# Altium schematic sheet MCU.SchDoc
size A3; SheetNumber: 3
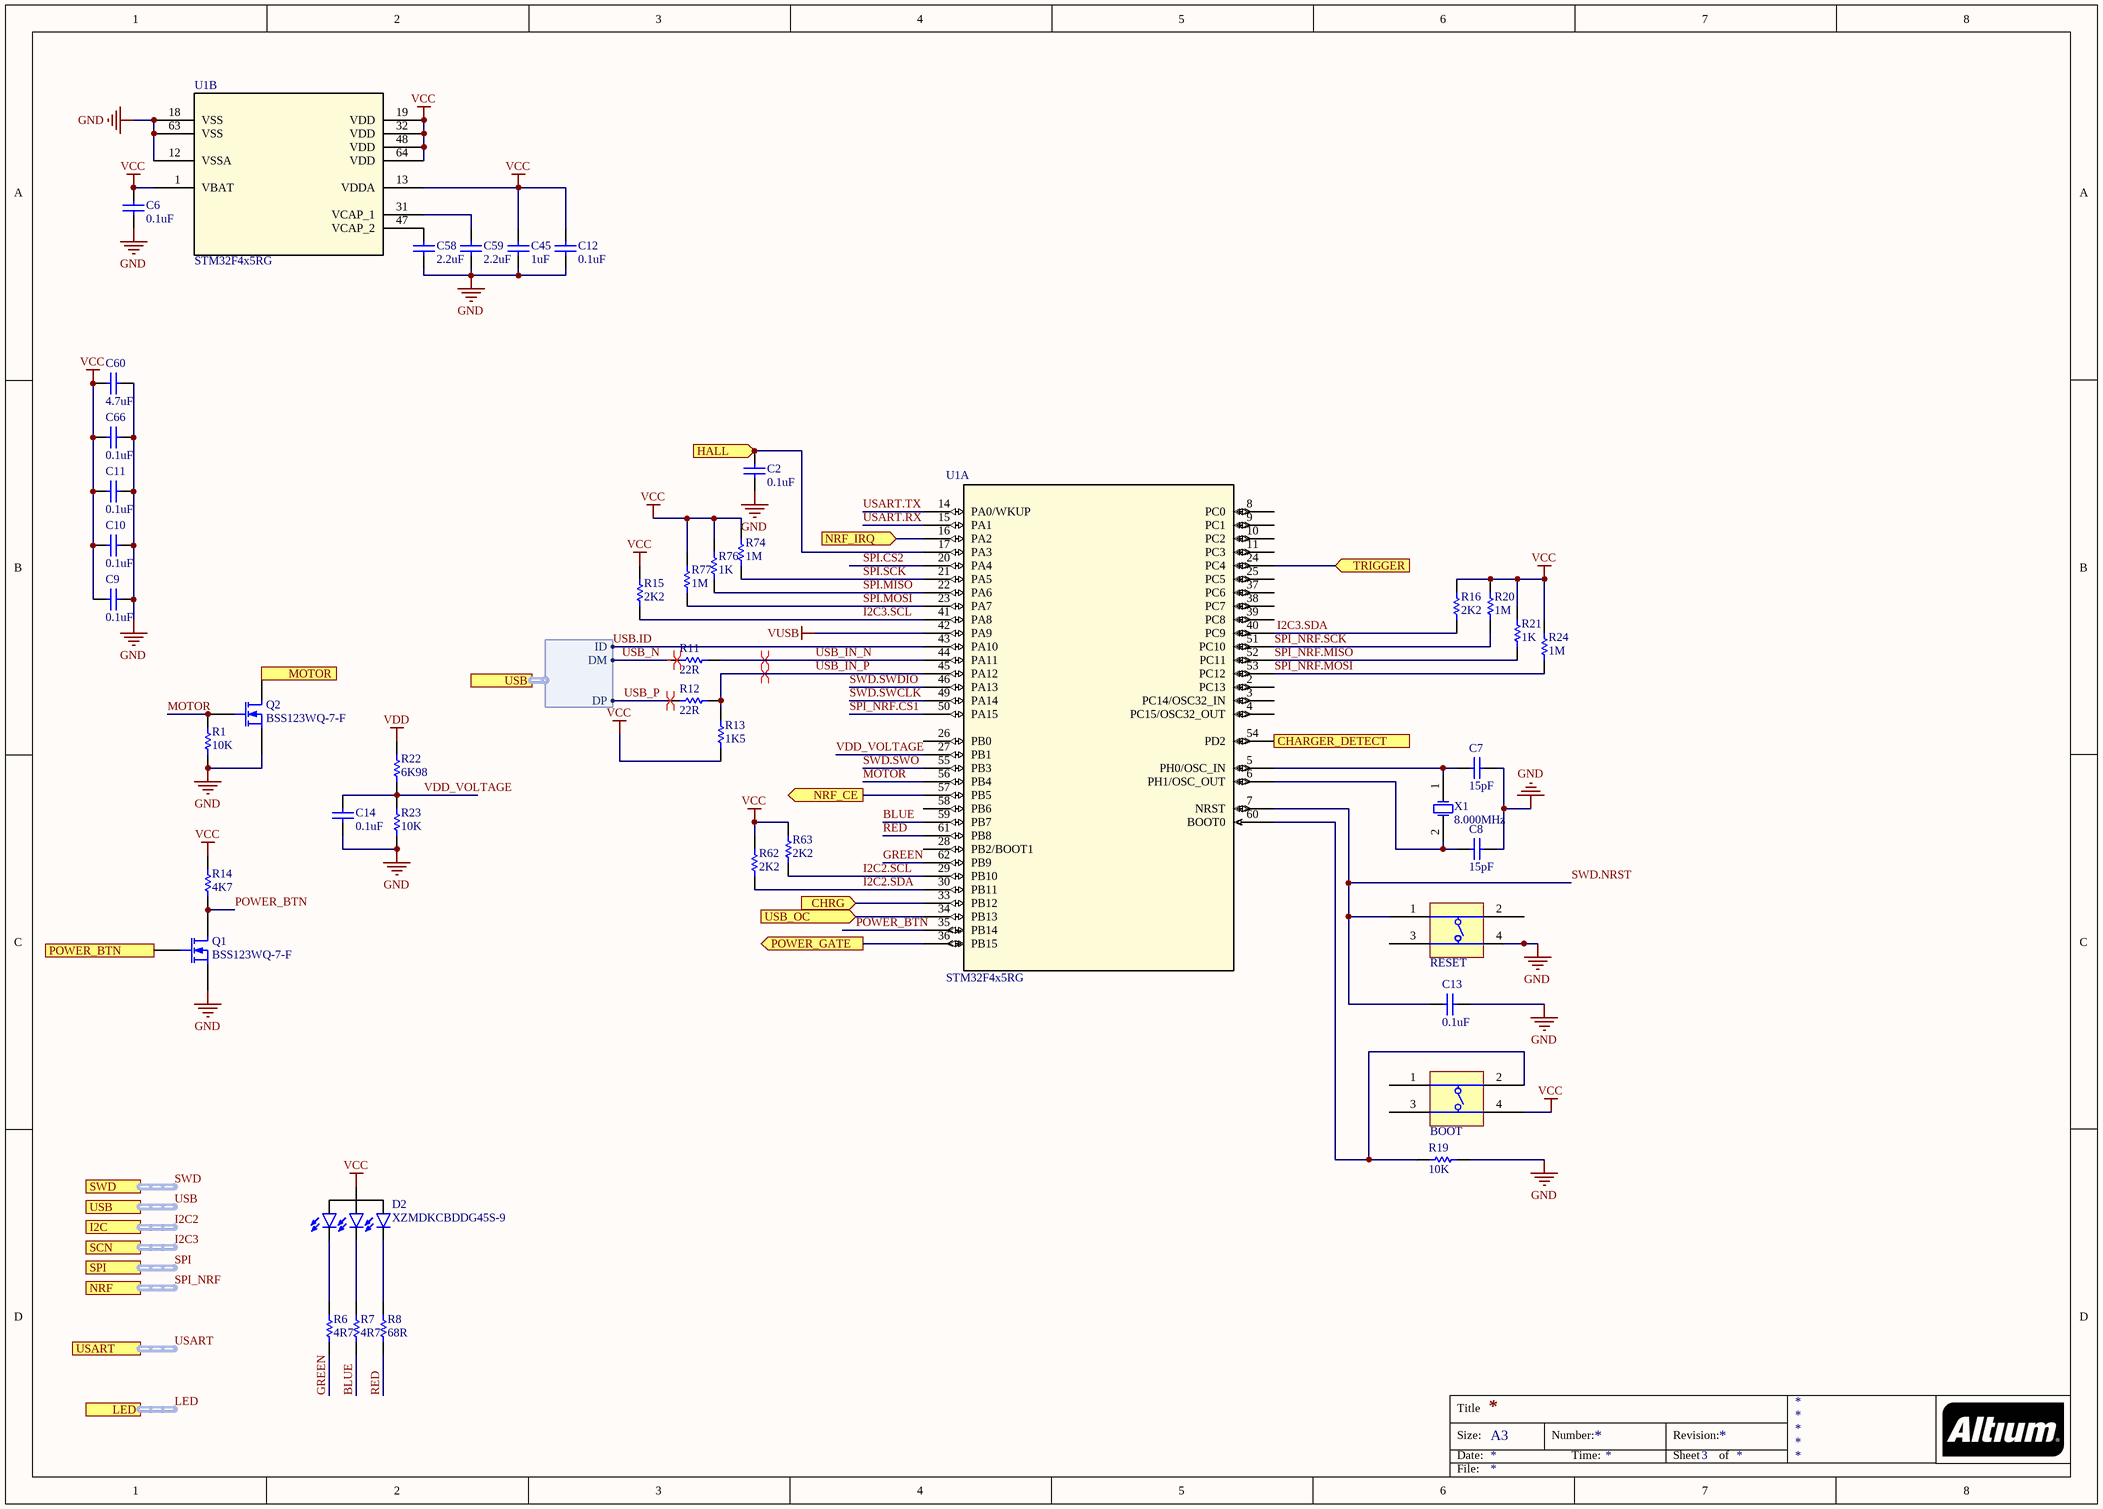
[diagram p0: MCU.SchDoc]

## Parts
BOOT  DIPT-DTSM-6  [SWITCH]  (value not drawn)
C2  value 0.1uF  [C0603[1608X92]]  (hidden comment: 0.1uF 6.3V 0603)
C6  value 0.1uF  [C0603[1608X92]]  (hidden comment: 0.1uF 6.3V 0603)
C7  value 15pF  [C0603[1608X92]]  (hidden comment: 15pF 50V 0603)
C8  value 15pF  [C0603[1608X92]]  (hidden comment: 15pF 50V 0603)
C9  value 0.1uF  [C0603[1608X92]]  (hidden comment: 0.1uF 6.3V 0603)
C10  value 0.1uF  [C0603[1608X92]]  (hidden comment: 0.1uF 6.3V 0603)
C11  value 0.1uF  [C0603[1608X92]]  (hidden comment: 0.1uF 6.3V 0603)
C12  value 0.1uF  [C0603[1608X92]]  (hidden comment: 0.1uF 6.3V 0603)
C13  value 0.1uF  [C0603[1608X92]]  (hidden comment: 0.1uF 6.3V 0603)
C14  value 0.1uF  [C0603[1608X92]]  (hidden comment: 0.1uF 6.3V 0603)
C45  value 1uF  [C0603[1608X92]]  (hidden comment: 1uF 6.3V 0603)
C58  value 2.2uF  [C1206[3216X160]]  (hidden comment: 2.2uF 6.3V 1206)
C59  value 2.2uF  [C1206[3216X160]]  (hidden comment: 2.2uF 6.3V 1206)
C60  value 4.7uF  [C0603[1608X92]]  (hidden comment: 4.7uF 6.3V 0603)
C66  value 0.1uF  [C0603[1608X92]]  (hidden comment: 0.1uF 6.3V 0603)
D2  XZMDKCBDDG45S-9  [XZMDKCBDDG45S-9]
Q1  BSS123WQ-7-F  [SOT323-3]
Q2  BSS123WQ-7-F  [SOT323-3]
R1  value 10K  [R0603[1608]]  (hidden comment: 10K 1% 0603)
R6  value 4R7  [R0603[1608]]  (hidden comment: 4R7 5% 0603)
R7  value 4R7  [R0603[1608]]  (hidden comment: 4R7 5% 0603)
R8  value 68R  [R0603[1608]]  (hidden comment: 68R 1% 0603)
R11  value 22R  [R0603[1608]]  (hidden comment: 22R 1% 0603)
R12  value 22R  [R0603[1608]]  (hidden comment: 22R 1% 0603)
R13  value 1K5  [R0603[1608]]  (hidden comment: 1K5 1% 0603)
R14  value 4K7  [R0603[1608]]  (hidden comment: 4K7 1% 0603)
R15  value 2K2  [R0603[1608]]  (hidden comment: 2K2 1% 0603)
R16  value 2K2  [R0603[1608]]  (hidden comment: 2K2 1% 0603)
R19  value 10K  [R0603[1608]]  (hidden comment: 10K 1% 0603)
R20  value 1M  [R0603[1608]]  (hidden comment: 1M 5% 0603)
R21  value 1K  [R0603[1608]]  (hidden comment: 1K 1% 0603)
R22  value 6K98  [R0603[1608]]  (hidden comment: 6K98 1% 0603)
R23  value 10K  [R0603[1608]]  (hidden comment: 10K 1% 0603)
R24  value 1M  [R0603[1608]]  (hidden comment: 1M 5% 0603)
R62  value 2K2  [R0603[1608]]  (hidden comment: 2K2 1% 0603)
R63  value 2K2  [R0603[1608]]  (hidden comment: 2K2 1% 0603)
R74  value 1M  [R0603[1608]]  (hidden comment: 1M 5% 0603)
R76  value 1K  [R0603[1608]]  (hidden comment: 1K 1% 0603)
R77  value 1M  [R0603[1608]]  (hidden comment: 1M 5% 0603)
RESET  DIPT-DTSM-6  [SWITCH]  (value not drawn)
U1  STM32F4x5RG  [LQFP64-10x10mm]  (parts A,B of 2)
X1  8.000MHz  [OSC_2SM_3R2x2R5]

## Ports
CHARGER_DETECT (in), CHRG (in), HALL (in), I2C (harness I2C), LED (harness LED), MOTOR (in), NRF (harness SPI), NRF_CE (out), NRF_IRQ (in), POWER_BTN (in), POWER_GATE (out), SCN (harness I2C), SPI (harness SPI), SWD (harness SWD), TRIGGER (in), USART (harness USART2), USB (harness USB), USB_OC (in)

## Harnesses
USB: DM, DP, ID

## Nets
GND: C2.1 C6.1 C7.2 C8.2 C9.2 C10.2 C11.2 C12.1 C13.2 C14.1 C45.1 C58.1 C59.1 C60.2 C66.2 Q1.2(S) Q2.2(S) R1.1 R19.2 R23.1 RESET.4 U1.12(VSSA) U1.18(VSS) U1.63(VSS)
VCC: BOOT.4 C6.2 C9.1 C10.1 C11.1 C12.2 C45.2 C60.1 C66.1 D2.2(A) R13.1 R14.2 R15.1 R16.1 R20.1 R21.1 R24.1 R62.1 R63.1 R74.1 R76.1 R77.1 U1.1(VBAT) U1.13(VDDA) U1.19(VDD) U1.32(VDD) U1.48(VDD) U1.64(VDD)
VDD: R22.2
VUSB: U1.42(PA9)
BLUE: R7.1 U1.59(PB7)
CHARGER_DETECT: U1.54(PD2) ; port CHARGER_DETECT
CHRG: U1.33(PB12) ; port CHRG
GREEN: R6.1 U1.62(PB9)
HALL: C2.2 U1.17(PA3) ; port HALL
I2C2.SCL: R63.2 U1.29(PB10)
I2C2.SDA: R62.2 U1.30(PB11)
I2C3.SCL: R15.2 U1.41(PA8)
I2C3.SDA: R16.2 U1.40(PC9)
MOTOR: Q2.1(G) R1.2 U1.56(PB4)
MOTOR: Q2.3(D) ; port MOTOR  [a separate net that carries the same name]
NRF_CE: U1.57(PB5) ; port NRF_CE
NRF_IRQ: U1.16(PA2) ; port NRF_IRQ
POWER_BTN: Q1.3(D) R14.1 U1.35(PB14)
POWER_BTN: Q1.1(G) ; port POWER_BTN  [a separate net that carries the same name]
POWER_GATE: U1.36(PB15) ; port POWER_GATE
RED: R8.1 U1.61(PB8)
SPI.CS2: U1.20(PA4)
SPI.MISO: R76.2 U1.22(PA6)
SPI.MOSI: R77.2 U1.23(PA7)
SPI.SCK: R74.2 U1.21(PA5)
SPI_NRF.CS1: U1.50(PA15)
SPI_NRF.MISO: R21.2 U1.52(PC11)
SPI_NRF.MOSI: R24.2 U1.53(PC12)
SPI_NRF.SCK: R20.2 U1.51(PC10)
SWD.NRST: C13.1 RESET.1 U1.7(NRST)
SWD.SWCLK: U1.49(PA14)
SWD.SWDIO: U1.46(PA13)
SWD.SWO: U1.55(PB3)
TRIGGER: U1.24(PC4) ; port TRIGGER
USART.RX: U1.15(PA1)
USART.TX: U1.14(PA0/WKUP)
USB.ID: U1.43(PA10) ; port USB.ID
USB_IN_N: R11.2 U1.44(PA11)
USB_IN_P: R12.2 R13.2 U1.45(PA12)
USB_N: R11.1 ; port USB.DM  [project net USB.DM]
USB_OC: U1.34(PB13) ; port USB_OC
USB_P: R12.1 ; port USB.DP  [project net USB.DP]
VDD_VOLTAGE: C14.2 R22.1 R23.2 U1.27(PB1)
NetBOOT_2: BOOT.2 R19.1 U1.60(BOOT0)
NetC7_1: C7.1 U1.5(PH0/OSC_IN) X1.1(OSC1)
NetC8_1: C8.1 U1.6(PH1/OSC_OUT) X1.2(OSC2)
NetC58_2: C58.2 U1.47(VCAP_2)
NetC59_2: C59.2 U1.31(VCAP_1)
NetD2_1: D2.1(K_Red) R8.2
NetD2_3: D2.3(K_Blue) R7.2
NetD2_4: D2.4(K_Green) R6.2

Not connected (* = marked no-connect by the designer): BOOT 1 3; RESET 2 3; U1 2(PC13) 3(PC14/OSC32_IN) 4(PC15/OSC32_OUT) 8(PC0) 9(PC1) 10(PC2) 11(PC3) 25(PC5) 26(PB0) 28(PB2/BOOT1) 37(PC6) 38(PC7) 39(PC8) 58(PB6)

## Buses and harness runs
harness I2C2 = port I2C
harness I2C3 = port SCN
harness LED = port LED
harness SPI = port SPI
harness SPI_NRF = port NRF
harness SWD = port SWD
harness USART = port USART
harness USB = port USB

## Layout directives
differential pair; rule Width Constraint [Pref Width = 10mil    Min Width = 10mil    Max Width = 10mil]: USB.DM
differential pair: USB.DP, USB_IN_N, USB_IN_P

## Notes on the sheet
- Title
- Size:
- Date:
- A3
- Number:
- Time:
- Revision:
- Sheet
- of
- File:

## Library data of the parts
BOOT RESET = DIPT-DTSM-6: Switch, SPNO Push Button SMD; Manufacturer: C&K Components; PartNumber: PTS810 SJM 250 SMTR LFS; PackageReference: PTS810
C2 C6 C9-C14 C66 = CAP_0.1uF_6.3V_0603_10%: 0.1uF 6.3V 10% 0603 (1608 Metric); PartNumber: GRM188R70J104KA01D; Manufacturer: Murata; Mounting Technology: Surface Mount; PackageReference: 0603; PackageDescription: 0603 (1608 Metric); Voltage: 6.3V; Tolerance: 10%
C7 C8 = CAP_15pF_50V_0603_1%: 15pF 50V 1% 0603 (1608 Metric); PartNumber: 06035A150FAT2A; Manufacturer: AVX Corporation; TemperatureCoefficient: C0G; Mounting Technology: Surface Mount; PackageReference: 0603; PackageDescription: 0603 (1608 Metric); Voltage: 50V; Tolerance: 1%
C45 = CAP_1uF_6.3V_0603_10%: 1uF 6.3V 10% 0603 (1608 Metric); PartNumber: GRM188R60J105KA01D; Manufacturer: Murata; TemperatureCoefficient: X5R; Mounting Technology: Surface Mount; PackageReference: 0603; PackageDescription: 0603 (1608 Metric); Voltage: 6.3V; Tolerance: 10%
C58 C59 = CAP_2.2uF_16V_1206_10%: 2.2uF 6.3V 10% 1206 (3216 Metric); PartNumber: C1206C225K4PACTU; Manufacturer: KEMET; Voltage: 16V; Mounting Technology: Surface Mount; PackageReference: 1206; PackageDescription: 1206 (3216 Metric); Tolerance: 10%
C60 = CAP_4.7uF_6.3V_0603_10%: 4.7uF 6.3V 10% 0603 (1608 Metric); PartNumber: GRM188R60J475KE19J; Manufacturer: Murata; TemperatureCoefficient: X5R; Mounting Technology: Surface Mount; PackageReference: 0603; PackageDescription: 0603 (1608 Metric); Voltage: 6.3V; Tolerance: 10%
D2 = XZMDKCBDDG45S-9: Manufacturer: SunLED; PartNumber: XZMDKCBDDG45S-9; PackageReference: 4-PLCC; Mounting Technology: Surface Mount; PackageDescription: 4-SMD, Gull Wing,  3.20mm L x 2.80mm W
Q1 Q2 = BSS123WQ-7-F: N-Channel MOSFET; Manufacturer: Diodes Incorporated; PackageReference: SOT-323-3; PartNumber: BSS123WQ-7-F; Mounting Technology: Surface Mount
R1 R19 R23 = RES_10K_0603_1%: 10K 0.25W 1% 0603 (1005 Metric); Manufacturer: Vishay / Dale; PartNumber: CRCW060310K0FKEAHP; Power: 0.25W; Tolerance: 1%; Mounting Technology: Surface Mount; PackageReference: 0603; PackageDescription: 0603 (1608 Metric); ComponentLink1Description: Datasheet; ComponentLink1URL: http://www.vishay.com/docs/20065/rcse3.pdf
R6 R7 = RES_4R7_0603_5%: 4R7 0.25W 5% 0603 (1005 Metric); Manufacturer: Rohm; PartNumber: ESR03EZPJ4R7; Tolerance: 5%; Power: 0.25W; Mounting Technology: Surface Mount; PackageReference: 0603; PackageDescription: 0603 (1608 Metric); ComponentLink1Description: Datasheet; ComponentLink1URL: http://www.vishay.com/docs/20043/crcwhpe3.pdf
R8 = RES_68R_0603_1%: 68R 0.25W 1% 0603 (1005 Metric); Manufacturer: Panasonic; PartNumber: ERJ-PA3F68R0V; Tolerance: 1%; Power: 0.25W; Mounting Technology: Surface Mount; PackageReference: 0603; PackageDescription: 0603 (1608 Metric); ComponentLink1Description: Datasheet; ComponentLink1URL: http://www.vishay.com/docs/20043/crcwhpe3.pdf
R11 R12 = RES_22R_0603_1%: 22R 0.25W 1% 0603 (1005 Metric); Manufacturer: Vishay / Dale; PartNumber: CRCW060322R0FKEAHP; Tolerance: 1%; Power: 0.25W; Mounting Technology: Surface Mount; PackageReference: 0603; PackageDescription: 0603 (1608 Metric); ComponentLink1Description: Datasheet; ComponentLink1URL: http://www.vishay.com/docs/20043/crcwhpe3.pdf
R13 = RES_1K5_0603_1%: 1K5 0.25W 1% 0603 (1005 Metric); Manufacturer: Vishay / Dale; PartNumber: CRCW06031K50FKEAHP; Tolerance: 1%; Power: 0.25W; Mounting Technology: Surface Mount; PackageReference: 0603; PackageDescription: 0603 (1608 Metric); ComponentLink1Description: Datasheet; ComponentLink1URL: http://www.vishay.com/docs/20043/crcwhpe3.pdf
R14 = RES_4K7_0603_1%: 4K7 0.25W 1% 0603 (1005 Metric); Manufacturer: Vishay / Dale; PartNumber: CRCW06034K70FKEAHP; Tolerance: 1%; Power: 0.25W; Mounting Technology: Surface Mount; PackageReference: 0603; PackageDescription: 0603 (1608 Metric); ComponentLink1Description: Datasheet; ComponentLink1URL: http://www.vishay.com/docs/20043/crcwhpe3.pdf
R15 R16 R62 R63 = RES_2K2_0603_1%: 2K2 0.25W 1% 0603 (1005 Metric); Manufacturer: Vishay / Dale; PartNumber: CRCW06032K20FKEAHP; Tolerance: 1%; Power: 0.25W; Mounting Technology: Surface Mount; PackageReference: 0603; PackageDescription: 0603 (1608 Metric); ComponentLink1Description: Datasheet; ComponentLink1URL: http://www.vishay.com/docs/20043/crcwhpe3.pdf
R20 R24 R74 R77 = RES_1M_0603_5%: 1M 0.25W 5% 0603 (1005 Metric); Manufacturer: Panasonic; PartNumber: ERJ-PA3J105V; Tolerance: 5%; Power: 0.25W; Mounting Technology: Surface Mount; PackageReference: 0603; PackageDescription: 0603 (1608 Metric); ComponentLink1Description: Datasheet; ComponentLink1URL: http://www.vishay.com/docs/20043/crcwhpe3.pdf
R21 R76 = RES_1K_0603_1%: 1K 0.25W 1% 0603 (1005 Metric); Manufacturer: Vishay / Dale; PartNumber: CRCW06031K00FKEAHP; Tolerance: 1%; Power: 0.25W; Mounting Technology: Surface Mount; PackageReference: 0603; PackageDescription: 0603 (1608 Metric); ComponentLink1Description: Datasheet; ComponentLink1URL: http://www.vishay.com/docs/20043/crcwhpe3.pdf
R22 = RES_6K98_0603_1%: 6K98 0.25W 1% 0603 (1005 Metric); Manufacturer: Vishay / Dale; PartNumber: CRCW06036K98FKEAHP; Tolerance: 1%; Power: 0.25W; Mounting Technology: Surface Mount; PackageReference: 0603; PackageDescription: 0603 (1608 Metric); ComponentLink1Description: Datasheet; ComponentLink1URL: http://www.vishay.com/docs/20043/crcwhpe3.pdf
U1 = STM32F4x5RG: Imported; PartNumber: STM32F405RG; Vendor: STMicroelectronics; Value: Value; Type: Type; RefDes: RefDes; Manufacturer: STMicroelectronics
X1 = XTAL_NX3225GD_8MHZ: Crystal Oscillator; Manufacturer: NX; PartNumber: NX3225GD-8MHZ-STD-CRA-3; PackageReference: 2-SMD; Value: 8.000MHz